# Altium schematic sheet led.SchDoc
size A4; Engineer: Amir Hossein Jobeiri; Organization: Simaran; SheetNumber: 14; SheetTotal: 24
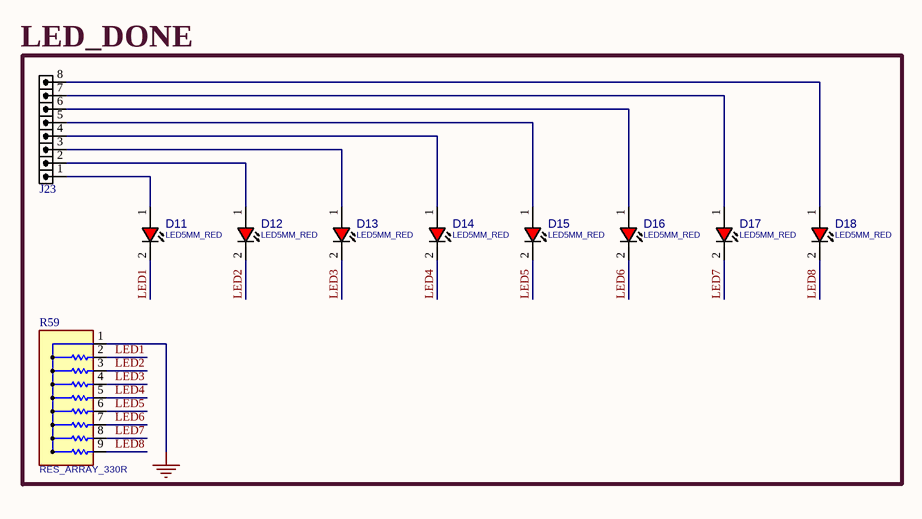
[diagram p0: led.SchDoc]

## Parts
D11  LED5MM_RED  [LED5MM_RED]
D12  LED5MM_RED  [LED5MM_RED]
D13  LED5MM_RED  [LED5MM_RED]
D14  LED5MM_RED  [LED5MM_RED]
D15  LED5MM_RED  [LED5MM_RED]
D16  LED5MM_RED  [LED5MM_RED]
D17  LED5MM_RED  [LED5MM_RED]
D18  LED5MM_RED  [LED5MM_RED]
J23  HDR1X8  [HDR_M_1X8]  (value not drawn)
R59  RES_ARRAY_330R  [RES_ARRAYX8]

## Blocks framed on the sheet
LED_DONE: D11-D18 J23 R59

## Nets
GND: R59.1
LED1: D11.2(CATHODE) R59.2
LED2: D12.2(CATHODE) R59.3
LED3: D13.2(CATHODE) R59.4
LED4: D14.2(CATHODE) R59.5
LED5: D15.2(CATHODE) R59.6
LED6: D16.2(CATHODE) R59.7
LED7: D17.2(CATHODE) R59.8
LED8: D18.2(CATHODE) R59.9
NetD11_1: D11.1(ANODE) J23.1
NetD12_1: D12.1(ANODE) J23.2
NetD13_1: D13.1(ANODE) J23.3
NetD14_1: D14.1(ANODE) J23.4
NetD15_1: D15.1(ANODE) J23.5
NetD16_1: D16.1(ANODE) J23.6
NetD17_1: D17.1(ANODE) J23.7
NetD18_1: D18.1(ANODE) J23.8

## Library data of the parts
D11-D18 = LED_THD_5MM_RED: LED, THD, 5MM, RED; DESC: DESCRIPTION; MANF_P#: MANF_PART#; PARAM2: 2.2V; MANF: MANF; ASSEMBLY: ASSEMBLY; PRICE: PRICE; VALUE: LED5MM_RED
J23 = HDR_M_1X8: CONN, HEADER, Male, pitch: 2.54mm, 8POS; VALUE: HDRM8
R59 = RES_THD_ARRAY: RESISTOR, THD, Array, 8RES; VALUE: RES_ARRAY_330R